# Altium schematic sheet TSAL.SchDoc
size A3; SheetNumber: 11; SheetTotal: 11
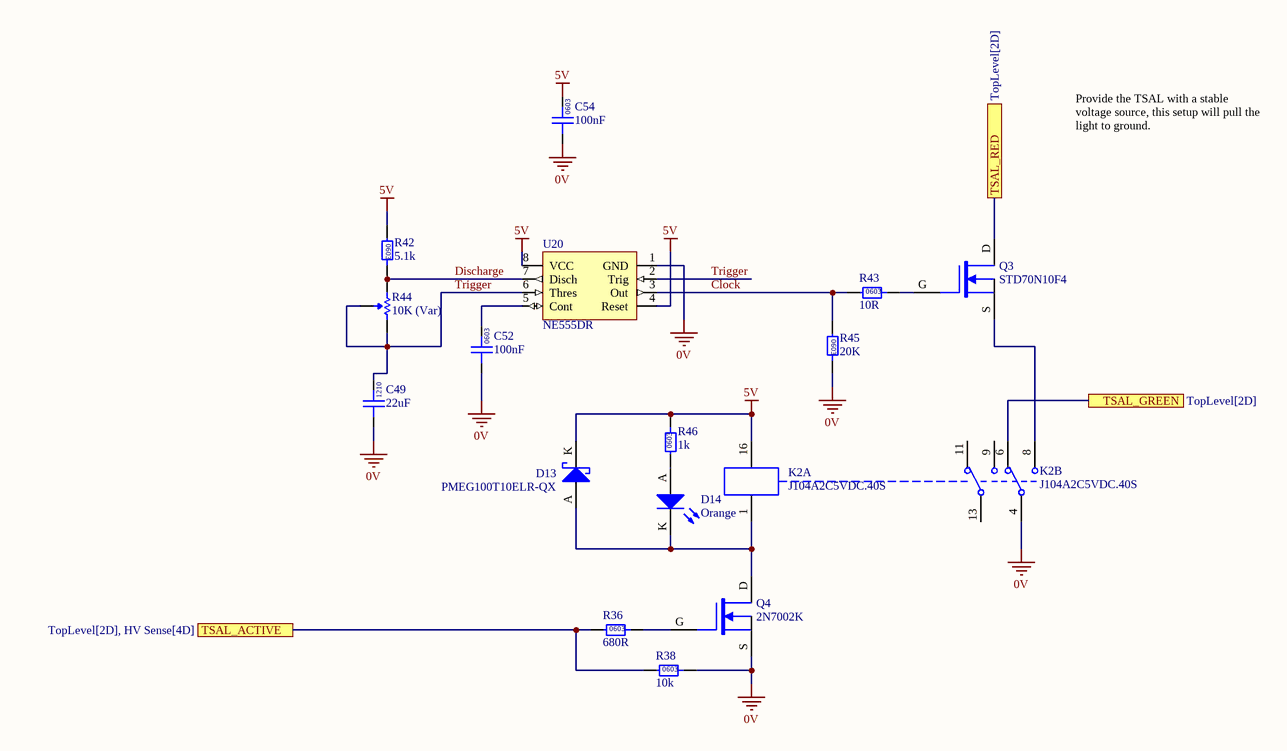
[diagram p0: TSAL.SchDoc]

## Parts
C49  22uF  [1210]
C52  100nF  [0603]
C54  100nF  [0603]
D13  PMEG100T10ELR-QX  [NXP SOD123W]
D14  Orange  [0805 LED]
K2  J104A2C5VDC.40S  [J104A2C5VDC.40S-Footprint-1]  (parts A,B of 2)
Q3  STD70N10F4  [STM TO-252 MOSFET]
Q4  2N7002K  [2N7002K-Footprint-1]
R36  680R  [0603]
R38  10k  [0603]
R42  5.1k  [0603]
R43  10R  [0603]
R44  10K (Var)  [B 3296]
R45  20K  [0603]
R46  1k  [0603]
U20  NE555DR  [TI 8-SOIC]

## Ports
TSAL_ACTIVE (see TopLevel[2D], HV Sense[4D]), TSAL_GREEN (see TopLevel[2D]), TSAL_RED (see TopLevel[2D])

## Nets
0V: C49.1 C52.1 C54.1 K2.4 Q4.S R38.2 R45.2 U20.1(GND)
5V: C54.2 D13.K K2.16 R42.1 R46.2 U20.4(Reset) U20.8(VCC)
Clock: R43.1 R45.1 U20.3(Out)
Discharge: R42.2 R44.3(CW) U20.7(Disch)
Trigger: C49.2 R44.1(CCW) R44.2(Wiper) U20.2(Trig) U20.6(Thres)
TSAL_ACTIVE: R36.1 R38.1 ; port TSAL_ACTIVE
TSAL_GREEN: K2.6 ; port TSAL_GREEN
TSAL_RED: Q3.D ; port TSAL_RED
NetC52_2: C52.2 U20.5(Cont)
NetD13_A: D13.A D14.K K2.1 Q4.D
NetD14_A: D14.A R46.1
NetK2_8: K2.8 Q3.S
NetQ3_G: Q3.G R43.2
NetQ4_G: Q4.G R36.2

Not connected (* = marked no-connect by the designer): K2 9 11 13

## Notes on the sheet
- Provide the TSAL with a stable voltage source, this setup will pull the light to ground.
- Section Leader Check:
- Date:
- Title:
- Revision
- Variant
- Project:
- Engineers:
- Sheet
- of
- (in symbol GCM188L81H104KA57D) 0603
- (in symbol GRM32ER71E226KE15L) 1210
- (in symbol RC0603FR-071KL) 0603
- (in symbol RC0603FR-0710KL) 0603
- (in symbol RC0603FR-0710RL) 0603
- (in symbol RC0603FR-0720KL) 0603
- (in symbol RC0603JR-075K1L) 0603
- (in symbol RC0603JR-13680RL) 0603

## Library data of the parts
C49 = GRM32ER71E226KE15L: Manufacturer: Murata Electronics; Rated Voltage: 25V; Tolerance: ±10%; Material: MLCC; Temperature Rating: X7R; Part Number: GRM32ER71E226KE15L; Value: 22uF; Digikey Part Number: 490-5313-2-ND
C52 C54 = GCM188L81H104KA57D: Manufacturer: muRata; Rated Voltage: 50V; Tolerance: ±10%; Material: MLCC; Temperature Rating: X8L; Part Number: GCM188L81H104KA57D; Value: 100nF; Digikey Part Number: 490-6049-1-ND
D13 = PMEG100T10ELR-QX: Manufacturer: Nexperia USA Inc.; Forward Voltage: 0.75 V @ 1A; Breakdown Voltage: 100 V; Rated Power: 680 mW; Part Number: PMEG100T10ELR-QX; Digikey Part Number: 1727-PMEG100T10ELR-QXCT-ND
D14 = SML-211DTT86: Orange LED Indication - Discrete 1.75V 0805 (2012 Metric); Manufacturer: ROHM Semiconductor; Part Number: SML-211DTT86; Colour: Orange; Digikey Part Number: 511-1291-1-ND
K2 = CMP-008-00001-1: Relay Gen Purpose DPDT 3A 5V
Q3 = STD70N10F4: N-Channel 100V 60A (Tc) 125W (Tc) Surface Mount DPAK; Manufacturer: STMicroelectronics; Published: 24-Mar-1999; LatestRevisionDate: 29-May-2009; LatestRevisionNote: IPC-7351 Footprint Added.; PackageVersion: Sep-2000; PackageReference: SOT-343; Publisher: Altium Limited; PackageDescription: 4-Pin SOT-343 Package 1.3 mm Pitch, 2.1 mm Lead Span; Part Number: STD70N10F4; Type: N-channel; Rated Power: 125W; Digikey Part Number: 497-8806-2-ND
Q4 = CMP-038-000000-2: 60V 380mA, NFET MOSTFET (Small Signal); Part Number: 2N7002K
R36 = RC0603JR-13680RL: Manufacturer: YAGEO; Tolerance: 0.01; Rated Power: 0.1W; Part Number: RC0603JR-13680RL; Value: 680R; Material: FR-07; Digikey Part Number: 13-RC0603JR-13680RLCT-ND
R38 = RC0603FR-0710KL: Manufacturer: YAGEO; Tolerance: 0.01; Rated Power: 0.1W; Part Number: RC0603FR-0710KL; Value: 10k; Material: FR-07; Digikey Part Number: 311-10.0KHRCT-ND
R42 = RC0603JR-075K1L: Manufacturer: YAGEO; Tolerance: 0.01; Rated Power: 0.1W; Part Number: RC0603JR-075K1L; Value: 5.1k; Material: FR-07; Digikey Part Number: 311-5.1KGRCT-ND
R43 = RC0603FR-0710RL: Manufacturer: YAGEO; Tolerance: 0.01; Rated Power: 0.1W; Part Number: RC0603FR-0710RL; Value: 10R; Material: FR-07; Digikey Part Number: 311-10.0HRCT-ND
R44 = 3296W-1-103LF: Manufacturer: Bournes Inc; Tolerance: 0.1; Rated Power: 0.5W; Part Number: 3296W-1-103LF; Value: 10K (Var); Digikey Part Number: 3296W-103LF-ND
R45 = RC0603FR-0720KL: Manufacturer: YAGEO; Tolerance: 0.01; Rated Power: 0.1W; Part Number: RC0603FR-0720KL; Value: 20K; Material: FR-07; Digikey Part Number: 311-20.0KHRCT-ND
R46 = RC0603FR-071KL: Manufacturer: YAGEO; Tolerance: 0.01; Rated Power: 0.1W; Part Number: RC0603FR-071KL; Value: 1k; Material: FR-07; Digikey Part Number: 311-1.00KHRCT-ND
U20 = CMP-022-000003-1: IC OSC SGL TIMER 100KHZ 8-SOIC; Part Number: NE555DR